# Altium project MYP.PrjPcb
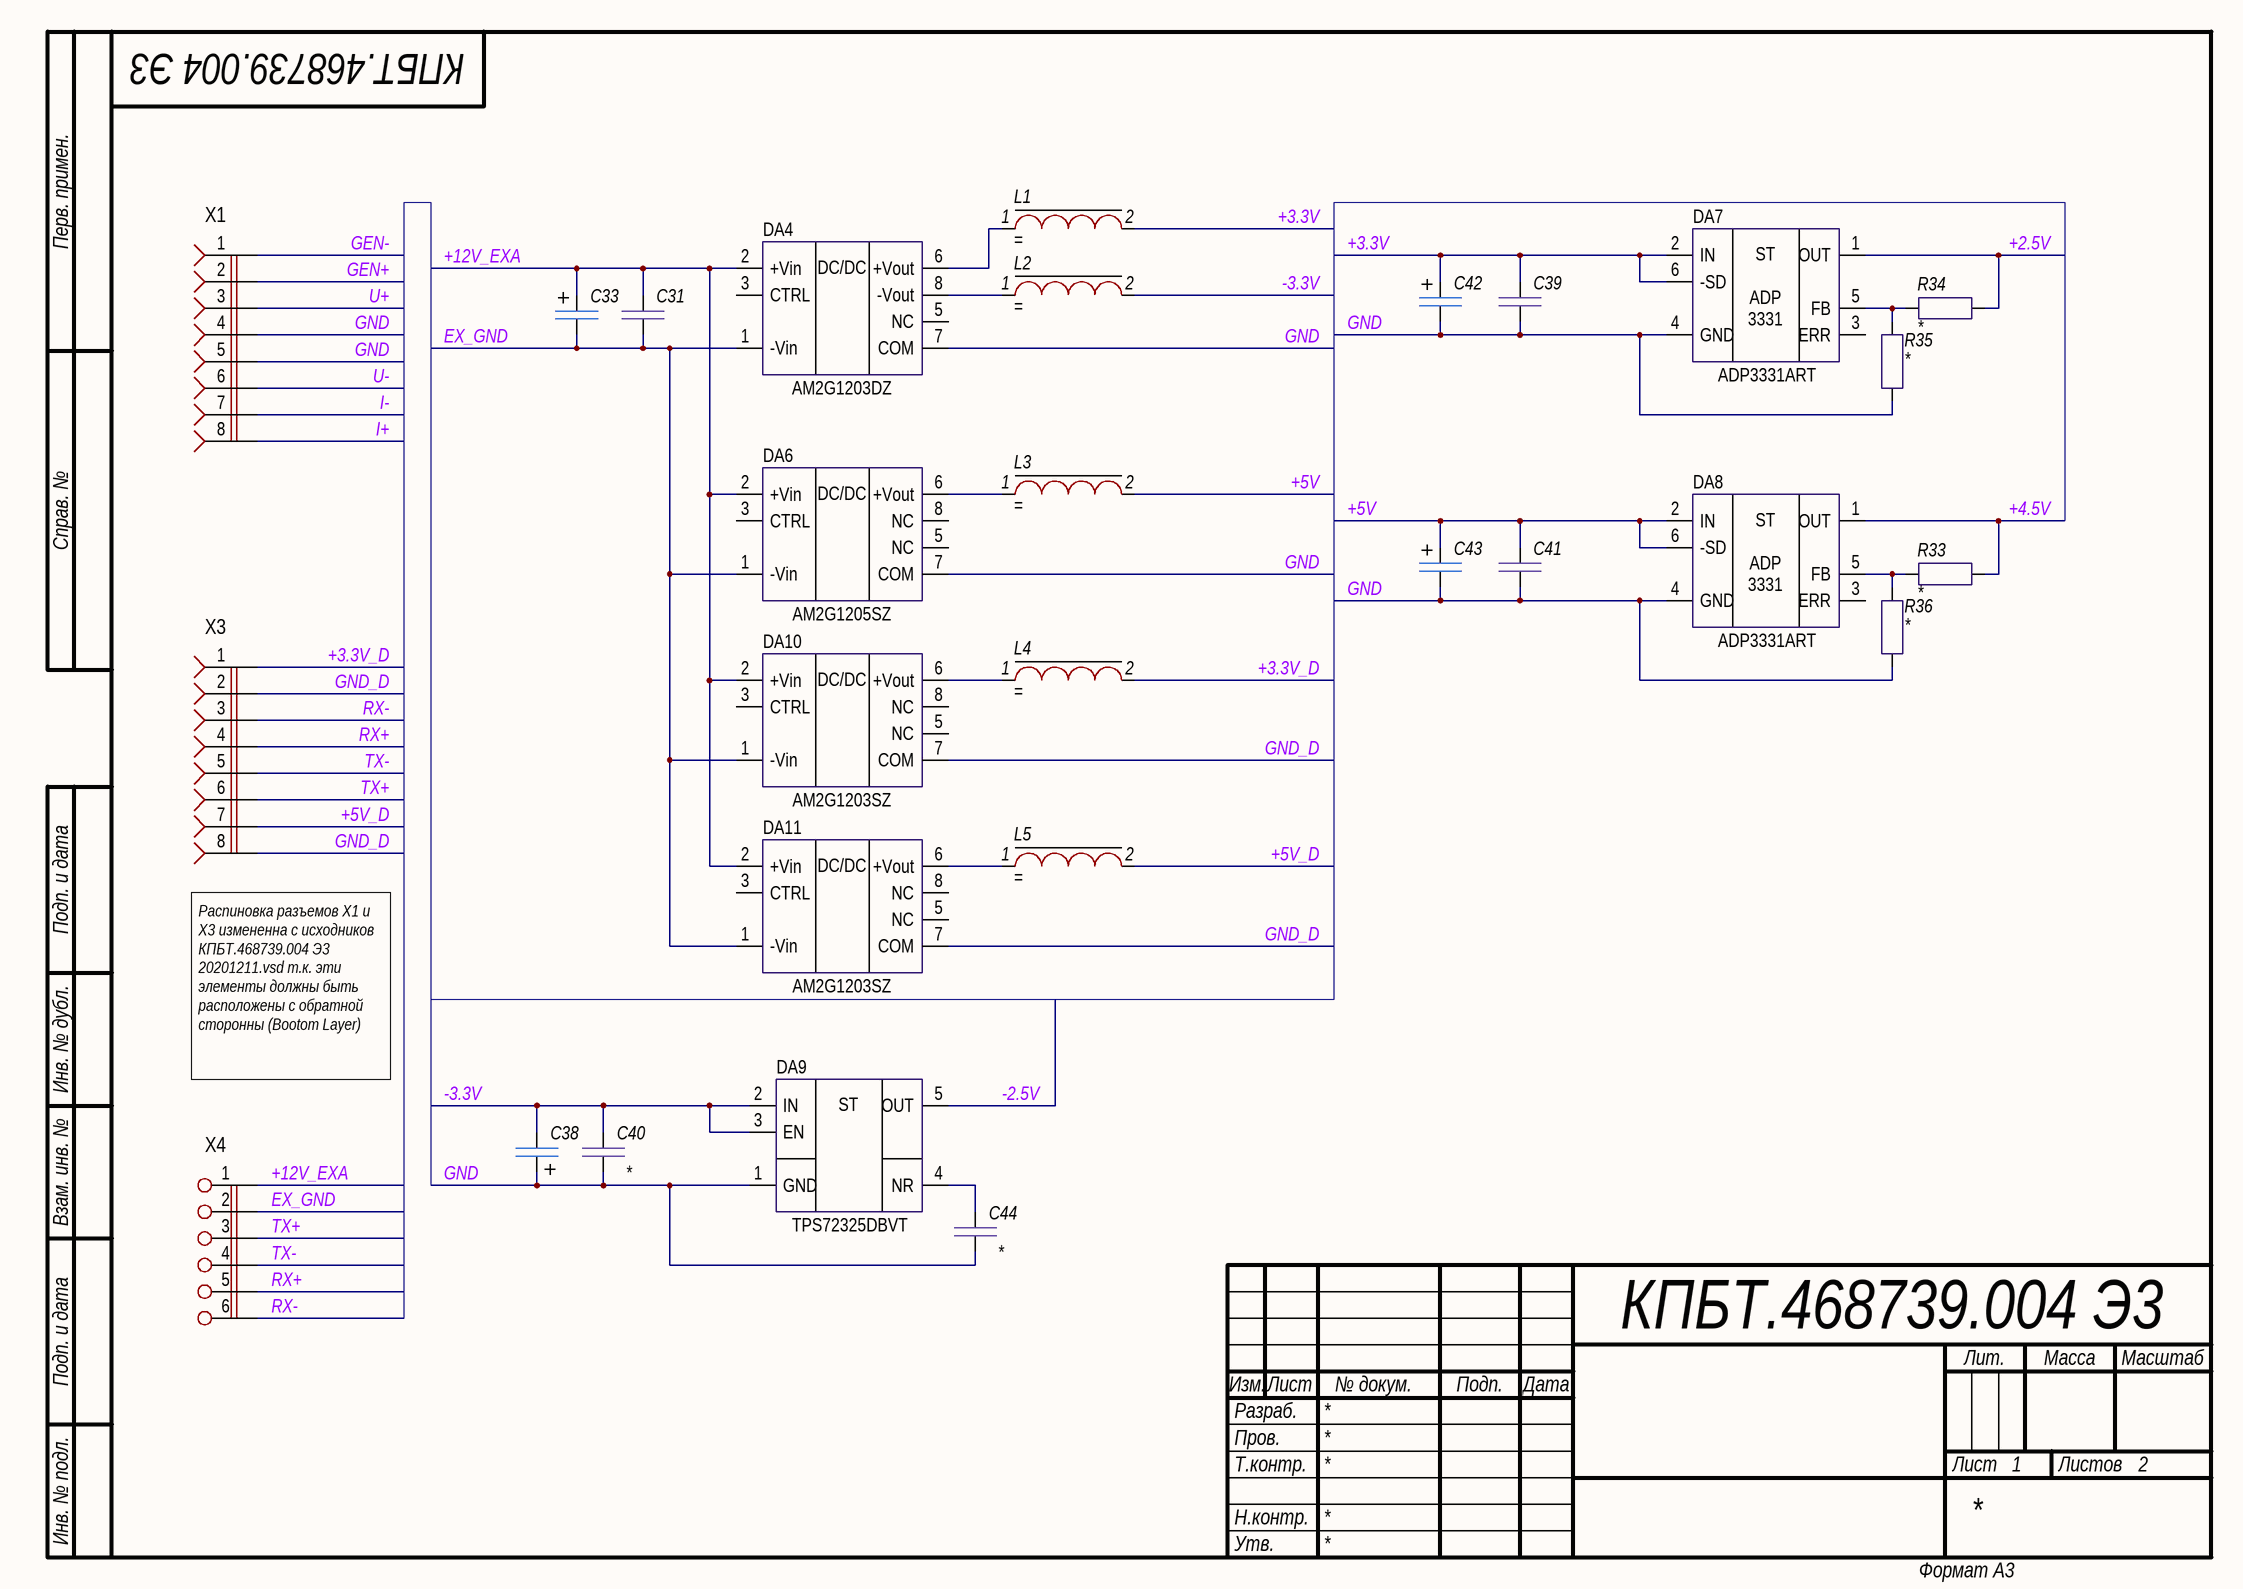
[diagram p0: Sheet1.SchDoc]
2 sheets, 125 parts. Net scope: global (net labels, ports and power ports of the same name join across sheets).
Board files: KPBT.758724.006.PcbDoc, КПБТ.758724.006_v2.PcbDoc
Sheets:
  Sheet1.SchDoc
  Sheet2.SchDoc

## Sheet Sheet1.SchDoc
size 420 x 297 mm; Address1: Address1; Address2: Address2; Address3: Address3; Address4: Address4; DocumentNumber: КПБТ.468739.004 Э3; SheetNumber: 1; SheetTotal: 2; Scale: 1:1; DocumentType: Схема электрическая принципиальная; FirstReferrence: АБВГ.123456.001

### Parts
C31  *  [CAP:0805]  (value not drawn)
C33  (no value)  [CAPT: tepy B]
C38  (no value)  [CAPT: tepy B]
C39  *  [CAP:0805]  (value not drawn)
C40  *  [CAP:0805]
C41  *  [CAP:0805]  (value not drawn)
C42  (no value)  [CAPT: tepy B]
C43  (no value)  [CAPT: tepy B]
C44  *  [CAP:0805]
DA4  AM2G1203DZ  [SIP-8]
DA6  AM2G1205SZ  [SIP-8]
DA7  ADP3331ART  [SOT23-6]
DA8  ADP3331ART  [SOT23-6]
DA9  TPS72325DBVT  [SOT23-5]
DA10  AM2G1203SZ  [SIP-8]
DA11  AM2G1203SZ  [SIP-8]
L1  (no value)  [LQH55DNxxM03]
L2  (no value)  [LQH55DNxxM03]
L3  (no value)  [LQH55DNxxM03]
L4  (no value)  [LQH55DNxxM03]
L5  (no value)  [LQH55DNxxM03]
R33  *  [RES:0805]
R34  *  [RES:0805]
R35  *  [RES:0805]
R36  *  [RES:0805]
X1  PBS-8  [PBS-8]  (value not drawn)
X3  PBS-8  [PBS-8]  (value not drawn)
X4  (no value)  [2EDGVM-5.0-06P-14-00AH]

### Nets
+2.5V: DA7.1(OUT) R34.2
+3.3V: C39.1 C42.2 DA7.2(IN) DA7.6(-SD) L1.2
+3.3V_D: L4.2 X3.1
+4.5V: DA8.1(OUT) R33.2
+5V: C41.1 C43.2 DA8.2(IN) DA8.6(-SD) L3.2
+5V_D: L5.2 X3.7
+12V_EXA: C31.1 C33.2 DA4.2(+Vin) DA6.2(+Vin) DA10.2(+Vin) DA11.2(+Vin) X4.1
-2.5V: DA9.5(OUT)
-3.3V: C38.1 C40.2 DA9.2(IN) DA9.3(EN) L2.2
EX_GND: C31.2 C33.1 DA4.1(-Vin) DA6.1(-Vin) DA10.1(-Vin) DA11.1(-Vin) X4.2
GEN+: X1.2
GEN-: X1.1
GND: C38.2 C39.2 C40.1 C41.2 C42.1 C43.1 C44.2 DA4.7(COM) DA6.7(COM) DA7.4(GND) DA8.4(GND) DA9.1(GND) R35.2 R36.2 X1.4 X1.5
GND_D: DA10.7(COM) DA11.7(COM) X3.2 X3.8
I+: X1.8
I-: X1.7
RX+: X3.4 X4.5
RX-: X3.3 X4.6
TX+: X3.6 X4.3
TX-: X3.5 X4.4
U+: X1.3
U-: X1.6
NetC44_1: C44.1 DA9.4(NR)
NetDA4_6: DA4.6(+Vout) L1.1
NetDA4_8: DA4.8(-Vout) L2.1
NetDA6_6: DA6.6(+Vout) L3.1
NetDA7_5: DA7.5(FB) R34.1 R35.1
NetDA8_5: DA8.5(FB) R33.1 R36.1
NetDA10_6: DA10.6(+Vout) L4.1
NetDA11_6: DA11.6(+Vout) L5.1

Not connected (* = marked no-connect by the designer): DA4 3(CTRL) 5(NC); DA6 3(CTRL) 5(NC) 8(NC); DA7 3(ERR); DA8 3(ERR); DA10 3(CTRL) 5(NC) 8(NC); DA11 3(CTRL) 5(NC) 8(NC)

### Notes on the sheet
- (near X3) Распиновка разъемов Х1 и Х3 измененна с исходников КПБТ.468739.004 Э3 20201211.vsd т.к. эти элементы должны быть расположены с обратной сторонны (Bootom Layer)
- Перв. примен.
- Справ. №
- Подп. и дата
- Инв. № дубл.
- Взам. инв. №
- Разраб.
- Изм.
- Лист
- № докум.
- Подп.
- Дата
- Лит.
- Масса
- Масштаб
- Пров.
- Т.контр.
- Листов
- Инв. № подл.
- Н.контр.
- Утв.
- Формат А3
- (in symbol ADP3331ART) ST / ADP / 3331
- (in symbol AM2G1203DZ) DC/DC
- (in symbol AM2G1203SZ) DC/DC
- (in symbol AM2G1205SZ) DC/DC
- (in symbol TPS72325DBVT) ST /

### Library data of the parts
C31 C39-C41 C44 = Capacitor 0805: Case: *; HelpURL: *; Manufacature: *; Model: *; Value: *; Part Number: Capacitor 0805
C33 C38 C42 C43 = CAPT: tepy B: Part Number: CAPT: tepy B
L1-L5 = LQH55DN101M03: Model: *; Manufcacture: *; HelpURL: *; Case: *; Value: *; Part Number: LQH55DN101M03
R33-R36 = Resistor 0805: Total Power Dissipation: 0,125W; Model: *; Manufcacture: *; HelpURL: *; Case: *; Value: *; Part Number: Resistor 0805
X4 = 2EDGxx-5.0-06P-14-00AH: Model: *; Manufcacture: *; HelpURL: *; Case: *; Value: *; Part Number: 2EDGxx-5.0-06P-14-00AH
DA4 = AM2G1203DZ: Model: *; Manufcacture: *; HelpURL: *; Case: *; Value: *; Part Number: AM2G1203DZ
DA6 = AM2G1205SZ: Model: *; Manufcacture: *; HelpURL: *; Case: *; Value: *; Part Number: AM2G1205SZ
DA7 DA8 = ADP3331ART: Model: *; Manufcacture: *; HelpURL: *; Case: *; Value: *; Part Number: ADP3331ART
DA9 = TPS72325DBVT: Model: *; Manufcacture: *; HelpURL: *; Case: *; Value: *; Part Number: TPS72325DBVT
DA10 DA11 = AM2G1203SZ: Model: *; Manufcacture: *; HelpURL: *; Case: *; Value: *; Part Number: AM2G1203SZ
X1 X3 = PBS-8: Value: *; Part Number: PBS-8

## Sheet Sheet2.SchDoc
size 420 x 297 mm; Address1: Address1; Address2: Address2; Address3: Address3; Address4: Address4; DocumentNumber: КПБТ.468739.004 Э3; SheetNumber: 1; Scale: 1:1; DocumentType: Схема электрическая принципиальная; FirstReferrence: АБВГ.123456.001
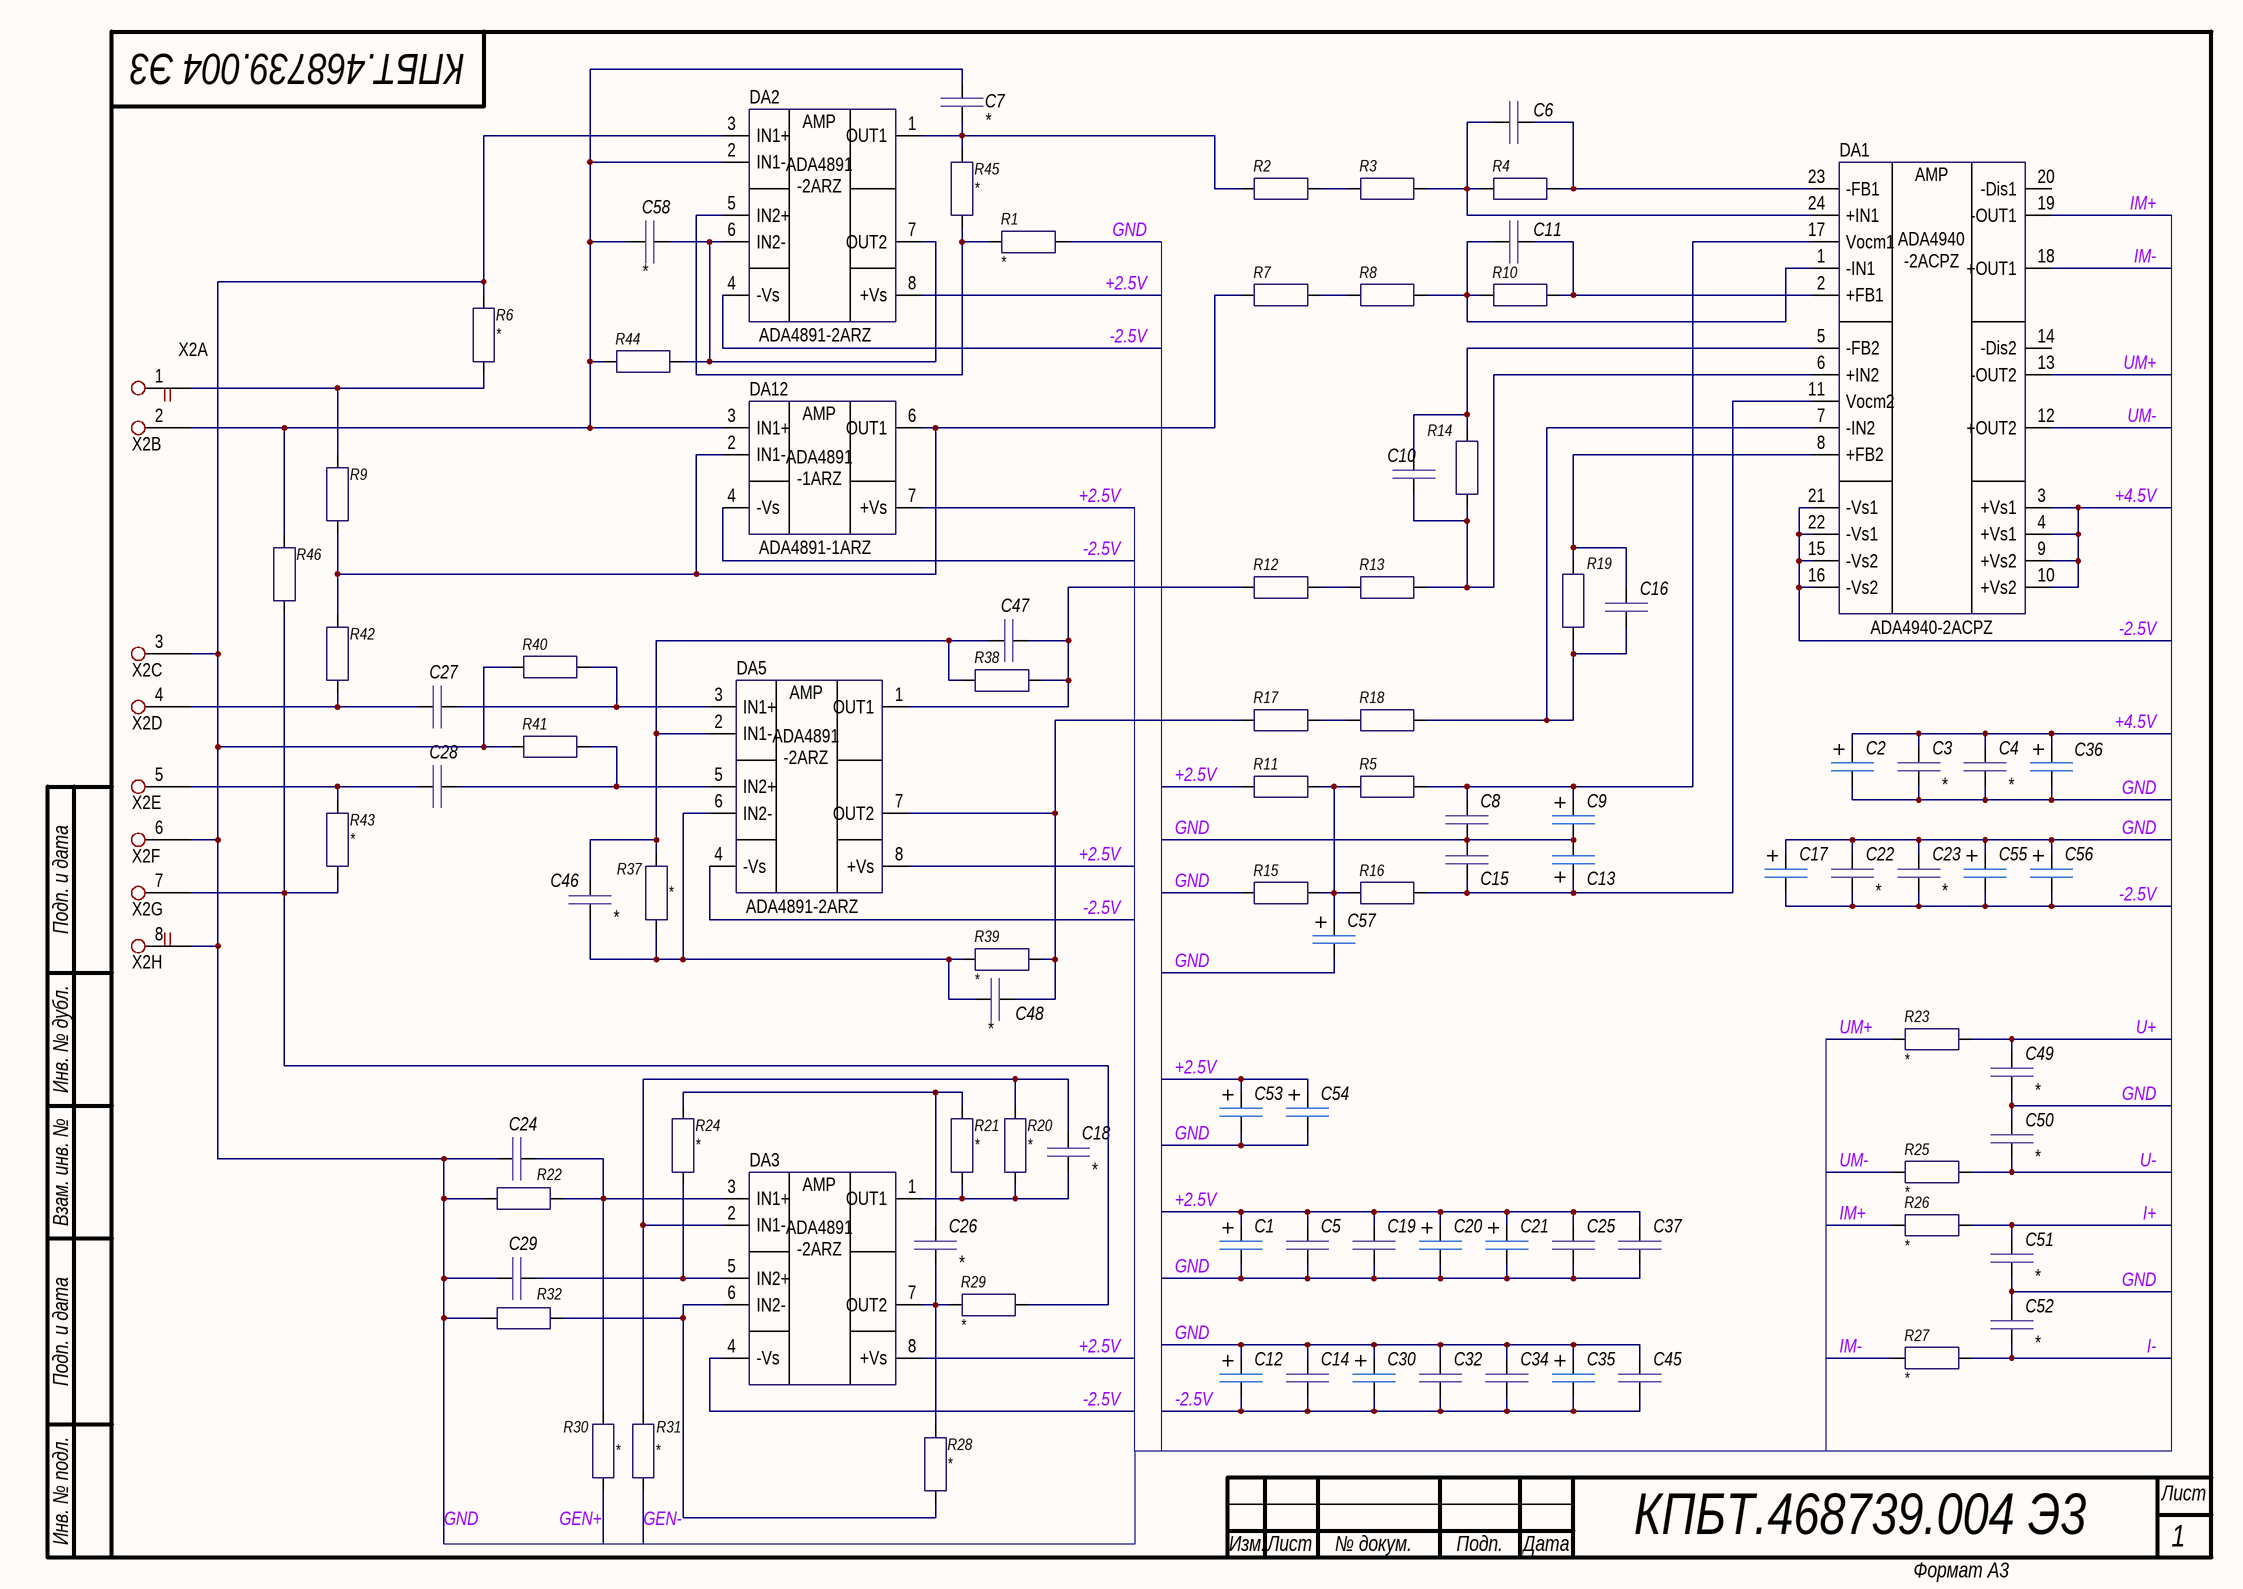
[diagram p1: Sheet2.SchDoc]

### Parts
C1  (no value)  [CAPT: tepy B]
C2  (no value)  [CAPT: tepy B]
C3  *  [CAP:0805]
C4  *  [CAP:0805]
C5  *  [CAP:0805]  (value not drawn)
C6  *  [CAP:0805]  (value not drawn)
C7  *  [CAP:0805]
C8  *  [CAP:0805]  (value not drawn)
C9  (no value)  [CAPT: tepy B]
C10  *  [CAP:0805]  (value not drawn)
C11  *  [CAP:0805]  (value not drawn)
C12  (no value)  [CAPT: tepy B]
C13  (no value)  [CAPT: tepy B]
C14  *  [CAP:0805]  (value not drawn)
C15  *  [CAP:0805]  (value not drawn)
C16  *  [CAP:0805]  (value not drawn)
C17  (no value)  [CAPT: tepy B]
C18  *  [CAP:0805]
C19  *  [CAP:0805]  (value not drawn)
C20  (no value)  [CAPT: tepy B]
C21  (no value)  [CAPT: tepy B]
C22  *  [CAP:0805]
C23  *  [CAP:0805]
C24  *  [CAP:0805]  (value not drawn)
C25  *  [CAP:0805]  (value not drawn)
C26  *  [CAP:0805]
C27  *  [CAP:0805]  (value not drawn)
C28  *  [CAP:0805]  (value not drawn)
C29  *  [CAP:0805]  (value not drawn)
C30  (no value)  [CAPT: tepy B]
C32  *  [CAP:0805]  (value not drawn)
C34  *  [CAP:0805]  (value not drawn)
C35  (no value)  [CAPT: tepy B]
C36  (no value)  [CAPT: tepy B]
C37  *  [CAP:0805]  (value not drawn)
C45  *  [CAP:0805]  (value not drawn)
C46  *  [CAP:0805]
C47  *  [CAP:0805]  (value not drawn)
C48  *  [CAP:0805]
C49  *  [CAP:0805]
C50  *  [CAP:0805]
C51  *  [CAP:0805]
C52  *  [CAP:0805]
C53  (no value)  [CAPT: tepy B]
C54  (no value)  [CAPT: tepy B]
C55  (no value)  [CAPT: tepy B]
C56  (no value)  [CAPT: tepy B]
C57  (no value)  [CAPT: tepy B]
C58  *  [CAP:0805]
DA1  ADA4940-2ACPZ  [LFCSP-24]
DA2  ADA4891-2ARZ  [SOIC-8]
DA3  ADA4891-2ARZ  [SOIC-8]  (value not drawn)
DA5  ADA4891-2ARZ  [SOIC-8]
DA12  ADA4891-1ARZ  [SOIC-8]
R1  *  [RES:0805]
R2  *  [RES:0805]  (value not drawn)
R3  *  [RES:0805]  (value not drawn)
R4  *  [RES:0805]  (value not drawn)
R5  *  [RES:0805]  (value not drawn)
R6  *  [RES:0805]
R7  *  [RES:0805]  (value not drawn)
R8  *  [RES:0805]  (value not drawn)
R9  *  [RES:0805]  (value not drawn)
R10  *  [RES:0805]  (value not drawn)
R11  *  [RES:0805]  (value not drawn)
R12  *  [RES:0805]  (value not drawn)
R13  *  [RES:0805]  (value not drawn)
R14  *  [RES:0805]  (value not drawn)
R15  *  [RES:0805]  (value not drawn)
R16  *  [RES:0805]  (value not drawn)
R17  *  [RES:0805]  (value not drawn)
R18  *  [RES:0805]  (value not drawn)
R19  *  [RES:0805]  (value not drawn)
R20  *  [RES:0805]
R21  *  [RES:0805]
R22  *  [RES:0805]  (value not drawn)
R23  *  [RES:0805]
R24  *  [RES:0805]
R25  *  [RES:0805]
R26  *  [RES:0805]
R27  *  [RES:0805]
R28  *  [RES:0805]
R29  *  [RES:0805]
R30  *  [RES:0805]
R31  *  [RES:0805]
R32  *  [RES:0805]  (value not drawn)
R37  *  [RES:0805]
R38  *  [RES:0805]  (value not drawn)
R39  *  [RES:0805]
R40  *  [RES:0805]  (value not drawn)
R41  *  [RES:0805]  (value not drawn)
R42  *  [RES:0805]  (value not drawn)
R43  *  [RES:0805]
R44  *  [RES:0805]  (value not drawn)
R45  *  [RES:0805]
R46  (no value)  [RES:0805]
X2  (no value)  [15EDGVC-3.5-08P-14-00AH]  (parts A,B,C,D,E,F,G,H of 8)

### Nets
+2.5V: C1.2 C5.2 C19.2 C20.2 C21.2 C25.2 C37.2 C53.2 C54.2 DA2.8(+Vs) DA3.8(+Vs) DA5.8(+Vs) DA12.7(+Vs) R11.2
+4.5V: C2.2 C3.2 C4.2 C36.2 DA1.3(+Vs1) DA1.4(+Vs1) DA1.9(+Vs2) DA1.10(+Vs2)
-2.5V: C12.1 C14.1 C17.1 C22.1 C23.1 C30.1 C32.1 C34.1 C35.1 C45.1 C55.1 C56.1 DA1.15(-Vs2) DA1.16(-Vs2) DA1.21(-Vs1) DA1.22(-Vs1) DA2.4(-Vs) DA3.4(-Vs) DA5.4(-Vs) DA12.4(-Vs)
GEN+: R30.1
GEN-: R31.1
GND: C1.1 C2.1 C3.1 C4.1 C5.1 C8.1 C9.1 C12.2 C13.1 C14.2 C15.2 C17.2 C19.1 C20.1 C21.1 C22.2 C23.2 C24.2 C25.1 C29.2 C30.2 C32.2 C34.2 C35.2 C36.1 C37.1 C45.2 C49.1 C50.2 C51.1 C52.2 C53.1 C54.1 C55.2 C56.2 C57.1 DA2.3(IN1+) R1.1 R6.2 R15.2 R22.2 R32.2 R40.2 R41.2 X2.3 X2.6 X2.8
I+: C51.2 R26.1
I-: C52.1 R27.1
IM+: DA1.19(-OUT1) R26.2
IM-: DA1.18(+OUT1) R27.2
U+: C49.2 R23.1
U-: C50.1 R25.1
UM+: DA1.13(-OUT2) R23.2
UM-: DA1.12(+OUT2) R25.2
NetC6_1: C6.1 DA1.23(-FB1) R4.1
NetC6_2: C6.2 DA1.24(+IN1) R3.1 R4.2
NetC7_1: C7.1 DA2.1(OUT1) R2.2 R45.2
NetC7_2: C7.2 C58.2 DA2.2(IN1-) DA12.3(IN1+) R44.2 R46.2 X2.2
NetC8_2: C8.2 C9.2 DA1.17(Vocm1) R5.1
NetC10_1: C10.1 DA1.5(-FB2) R14.1
NetC10_2: C10.2 DA1.6(+IN2) R13.1 R14.2
NetC11_1: C11.1 DA1.2(+FB1) R10.1
NetC11_2: C11.2 DA1.1(-IN1) R8.1 R10.2
NetC13_2: C13.2 C15.1 DA1.11(Vocm2) R16.1
NetC16_1: C16.1 DA1.7(-IN2) R18.1 R19.2
NetC16_2: C16.2 DA1.8(+FB2) R19.1
NetC18_1: C18.1 DA3.1(OUT1) R20.1 R21.1
NetC18_2: C18.2 DA3.2(IN1-) R20.2 R31.2
NetC24_1: C24.1 DA3.3(IN1+) R22.1 R30.2
NetC26_1: C26.1 DA3.7(OUT2) R28.2 R29.1
NetC26_2: C26.2 R21.2 R24.2
NetC27_1: C27.1 DA5.3(IN1+) R40.1
NetC27_2: C27.2 R42.1 X2.4
NetC28_1: C28.1 DA5.5(IN2+) R41.1
NetC28_2: C28.2 R43.2 X2.5
NetC29_1: C29.1 DA3.5(IN2+) R24.1
NetC46_1: C46.1 C47.2 DA5.2(IN1-) R37.1 R38.2
NetC46_2: C46.2 C48.1 DA5.6(IN2-) R37.2 R39.1
NetC47_1: C47.1 DA5.1(OUT1) R12.2 R38.1
NetC48_2: C48.2 DA5.7(OUT2) R17.2 R39.2
NetC57_2: C57.2 R5.2 R11.1 R15.1 R16.2
NetC58_1: C58.1 DA2.6(IN2-) DA2.7(OUT2) R44.1
NetDA2_5: DA2.5(IN2+) R1.2 R45.1
NetDA3_6: DA3.6(IN2-) R28.1 R32.1
NetDA12_2: DA12.2(IN1-) DA12.6(OUT1) R7.2 R9.1 R42.2
NetR2_1: R2.1 R3.2
NetR6_1: R6.1 R9.2 X2.1
NetR7_1: R7.1 R8.2
NetR12_1: R12.1 R13.2
NetR17_1: R17.1 R18.2
NetR29_2: R29.2 R43.1 R46.1 X2.7

Not connected (* = marked no-connect by the designer): DA1 14(-Dis2) 20(-Dis1)

### Notes on the sheet
- Подп. и дата
- Инв. № дубл.
- Взам. инв. №
- Инв. № подл.
- Изм.
- Лист
- № докум.
- Подп.
- Дата
- Формат А3
- (in symbol ADA4891-1ARZ) AMP / ADA4891 / -1ARZ /
- (in symbol ADA4891-2ARZ) AMP / ADA4891 / -2ARZ /
- (in symbol ADA4940-2ACPZ) AMP / ADA4940 / -2ACPZ /

### Library data of the parts
C1 C2 C9 C12 C13 C17 C20 C21 C30 C35 C36 C53-C57 = CAPT: tepy B: Part Number: CAPT: tepy B
C3-C8 C10 C11 C14-C16 C18 C19 C22-C29 C32 C34 C37 C45-C52 C58 = Capacitor 0805: Case: *; HelpURL: *; Manufacature: *; Model: *; Value: *; Part Number: Capacitor 0805
R1-R32 R37-R46 = Resistor 0805: Total Power Dissipation: 0,125W; Model: *; Manufcacture: *; HelpURL: *; Case: *; Value: *; Part Number: Resistor 0805
X2 = 15EDGVC-3.5-08P-14-00AH_1: Model: *; Manufcacture: *; HelpURL: *; Case: *; Value: *; Part Number: 15EDGVC-3.5-08P-14-00AH_1
DA1 = ADA4940-2ACPZ: Model: *; Manufcacture: *; HelpURL: *; Case: *; Value: *; Part Number: ADA4940-2ACPZ
DA2 DA3 DA5 = ADA4891-2ARZ: Model: *; Manufcacture: *; HelpURL: *; Case: *; Value: *; Part Number: ADA4891-2ARZ
DA12 = ADA4891-1ARZ: Model: *; Manufcacture: *; HelpURL: *; Case: *; Value: *; Part Number: ADA4891-1ARZ

## Nets that join several sheets
+2.5V: Sheet1 (DA7.1 R34.2), Sheet2 (14 pins)
+4.5V: Sheet1 (DA8.1 R33.2), Sheet2 (8 pins)
-2.5V: Sheet1 (DA9.5), Sheet2 (20 pins)
GEN+: Sheet1 (X1.2), Sheet2 (R30.1)
GEN-: Sheet1 (X1.1), Sheet2 (R31.1)
GND: Sheet1 (16 pins), Sheet2 (47 pins)
I+: Sheet1 (X1.8), Sheet2 (C51.2 R26.1)
I-: Sheet1 (X1.7), Sheet2 (C52.1 R27.1)
U+: Sheet1 (X1.3), Sheet2 (C49.2 R23.1)
U-: Sheet1 (X1.6), Sheet2 (C50.1 R25.1)